# EAGLE design flatmate-long (EAGLE 5.10)
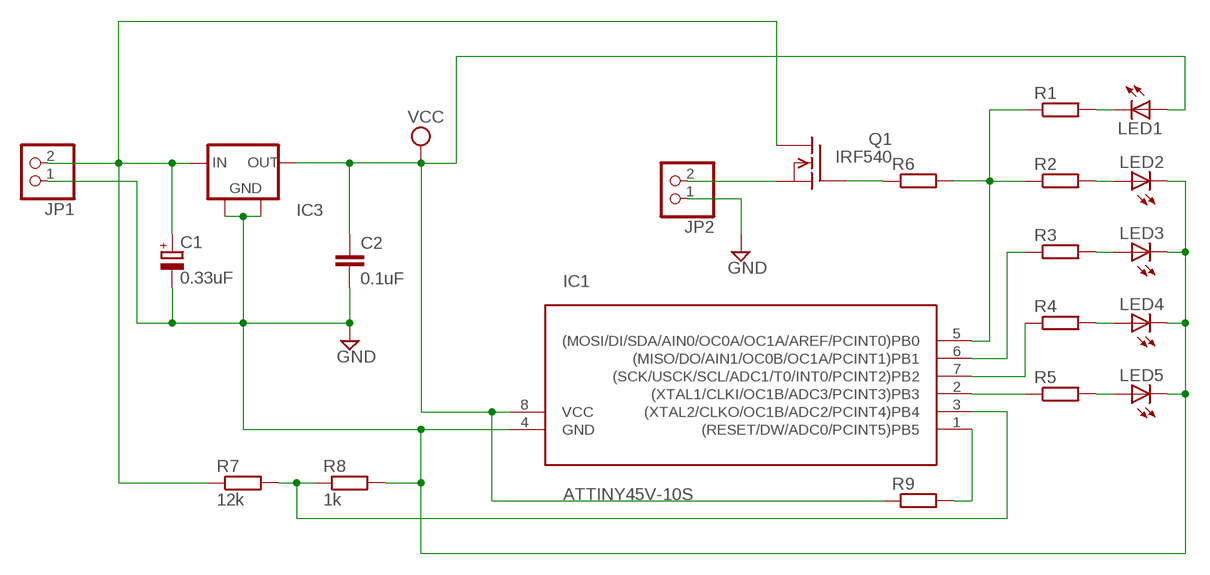
[diagram p0: schematic, sheet 1]

## Parts
C1  0.33uF  CPOL-EU153CLV-0405  [153CLV-0405]
C2  0.1uF  C-EUC0805  [C0805]
IC1  ATTINY45V-10S  [SOIC8]
IC3  78LXX-4SOT89  [SOT89R]
JP1  PINHD-1X2  [1X02]
JP2  PINHD-1X2  [1X02]
LED1  LEDCHIPLED_1206  [CHIPLED_1206]
LED2  LEDCHIPLED_1206  [CHIPLED_1206]
LED3  LEDCHIPLED_1206  [CHIPLED_1206]
LED4  LEDCHIPLED_1206  [CHIPLED_1206]
LED5  LEDCHIPLED_1206  [CHIPLED_1206]
Q1  IRF540  [TO220]
R1  R-EU_M0805  [M0805]
R2  R-EU_M0805  [M0805]
R3  R-EU_M0805  [M0805]
R4  R-EU_M0805  [M0805]
R5  R-EU_M0805  [M0805]
R6  R-EU_M0805  [M0805]
R7  12k  R-EU_M0805  [M0805]
R8  1k  R-EU_M0805  [M0805]
R9  R-EU_M0805  [M0805]

## Nets
GND: C1.- C2.2 IC1.4(GND) IC3.3(GND) IC3.4(GND) JP1.1 JP2.1 LED2.C LED3.C LED4.C LED5.C R8.2
N$1: LED1.C R1.2
N$2: Q1.1(G) R6.1
N$3: JP2.2 Q1.3(S)
N$4: IC1.1((RESET/DW/ADC0/PCINT5)PB5) R9.2
N$5: IC1.2((XTAL1/CLKI/OC1B/ADC3/PCINT3)PB3) R5.1
N$6: LED5.A R5.2
N$7: IC1.7((SCK/USCK/SCL/ADC1/T0/INT0/PCINT2)PB2) R4.1
N$8: LED4.A R4.2
N$9: IC1.6((MISO/DO/AIN1/OC0B/OC1A/PCINT1)PB1) R3.1
N$10: IC1.5((MOSI/DI/SDA/AIN0/OC0A/OC1A/AREF/PCINT0)PB0) R1.1 R2.1 R6.2
N$11: LED3.A R3.2
N$12: LED2.A R2.2
VCC: C2.1 IC1.8(VCC) IC3.2(OUT) LED1.A R9.1
VIN: C1.+ IC3.1(IN) JP1.2 Q1.2(D) R7.1
VSENSE: IC1.3((XTAL2/CLKO/OC1B/ADC2/PCINT4)PB4) R7.2 R8.1

## Library data of the parts
C1 = rcl:CPOL-EU: POLARIZED CAPACITOR, European symbol
C2 = rcl:C-EU: CAPACITOR, European symbol
IC1 = avr:ATTINY45: MICROCONTROLLER 4 Kbytes FLASH 256 bytes EEPROM 256 bytes RAM 4-channel 10 bit ADC USI
IC3 = ads4:78LXX-4: 78LXX low-power regulator -- 3-pin-plus-tab version
JP1 JP2 = pinhead:PINHD-1X2: PIN HEADER
LED1-LED5 = led:LED: LED OSRAM: - CHIPLED LG R971, LG N971, LY N971, LG Q971, LY Q971, LO R971, LY R971 LH N974, LH R974 LS Q976, LO Q976, LY Q976 LO Q996 - Hyper CHIPLED LW Q18S LB Q993, LB Q99A, LB R99A - SideLED LS A670, LO A670, LY A670, LG A670, LP A670 LB A673, LV A673, LT A673, LW A673 LH A674 LY A675 LS A676, LA A676, LO A676, LY A676, LW A676 LS A679, LY A679, LG A679 - Hyper Micro SIDELED® LS Y876, LA Y876, LO Y876, LY Y876 LT Y87S - SmartLED LW L88C, LW L88S LB L89C, LB L89S, LG L890 LS L89K, LO L89K, LY L89K LS L896, LA L896, LO L896, LY L896 - TOPLED LS T670, LO T670, LY T670, LG T670, LP T670 LSG T670, LSP T670, LSY T670, LOP T670, LYG T670 LG T671, LOG T671, LSG T671 LB T673, LV T673, LT T673, LW T673 LH T674 LS T676, LA T676, LO T676, LY T676, LB T676, LH T676, LSB T676, LW T676 LB T67C, LV T67C, LT T67C, LS T67K, LO T67K, LY T67K, LW E67C LS E67B, LA E67B, LO E67B, LY E67B, LB E67C, LV E67C, LT E67C LW T67C LS T679, LY T679, LG T679 LS T770, LO T770, LY T770, LG T770, LP T770 LB T773, LV T773, LT T773, LW T773 LH T774 LS E675, LA E675, LY E675, LS T675 LS T776, LA T776, LO T776, LY T776, LB T776 LHGB T686 LT T68C, LB T68C - Hyper Mini TOPLED® LB M676 - Mini TOPLED Santana® LG M470 LS M47K, LO M47K, LY M47K Source: http://www.osram.convergy.de LUXEON: - LUMILED® LXK2-PW12-R00, LXK2-PW12-S00, LXK2-PW14-U00, LXK2-PW14-V00 LXK2-PM12-R00, LXK2-PM12-S00, LXK2-PM14-U00 LXK2-PE12-Q00, LXK2-PE12-R00, LXK2-PE12-S00, LXK2-PE14-T00, LXK2-PE14-U00 LXK2-PB12-K00, LXK2-PB12-L00, LXK2-PB12-M00, LXK2-PB14-N00, LXK2-PB14-P00, LXK2-PB14-Q00 LXK2-PR12-L00, LXK2-PR12-M00, LXK2-PR14-Q00, LXK2-PR14-R00 LXK2-PD12-Q00, LXK2-PD12-R00, LXK2-PD12-S00 LXK2-PH12-R00, LXK2-PH12-S00 LXK2-PL12-P00, LXK2-PL12-Q00, LXK2-PL12-R00 Source: www.luxeon.com KINGBRIGHT: KA-3528ASYC Source: www.kingbright.com
Q1 = transistor-fet:IRF540: N-Channel Enhancement MOSFET (HEXFET); 100V; 28A; 0,077Ohm
R1-R9 = rcl:R-EU_: RESISTOR, European symbol

## Board
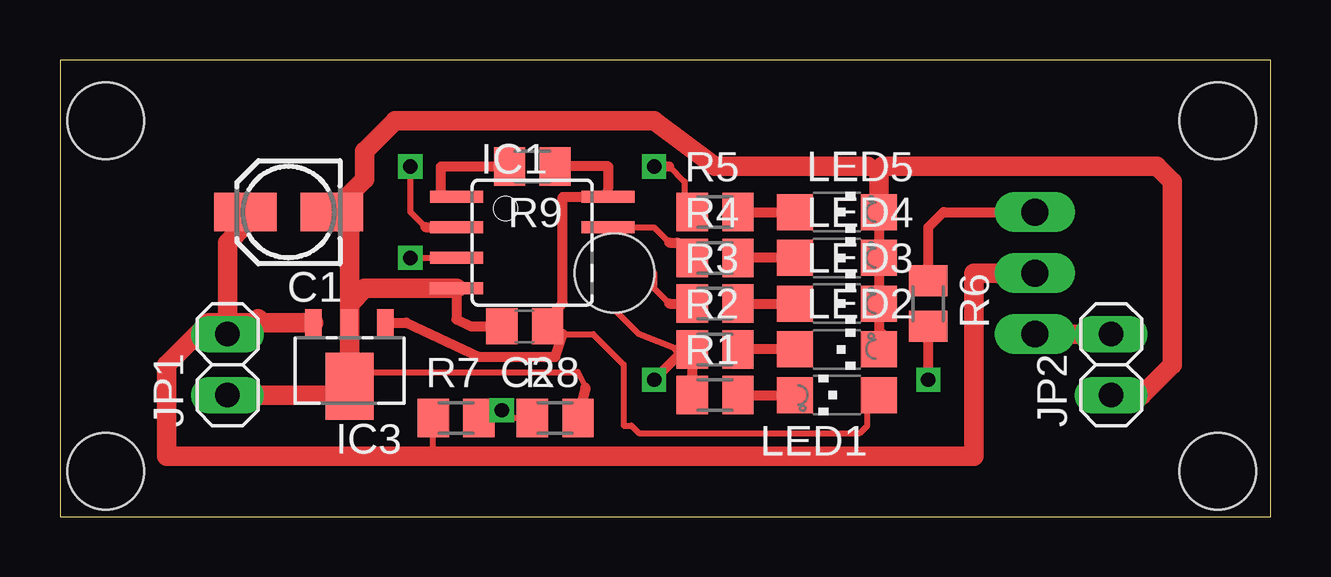
[diagram p1: board, top side]
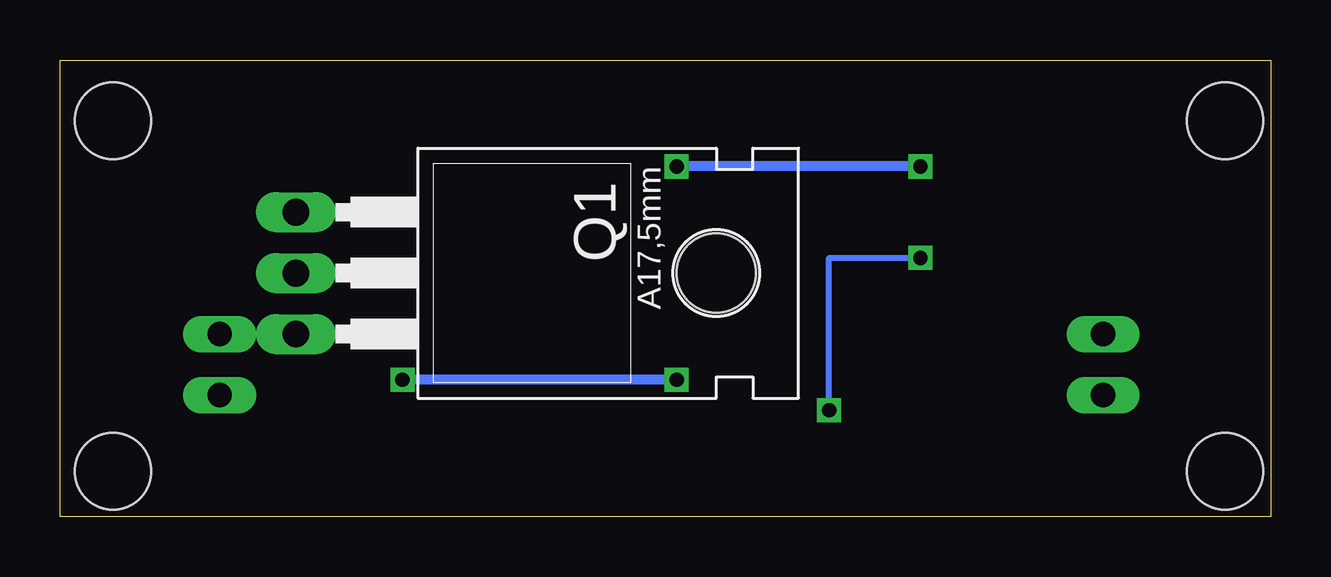
[diagram p2: board, bottom side, seen from below]

Size 50.47 x 19.04 mm. Coordinates in mm from the lower left corner, seen from the top.
Outline: 0,0 50.47,0 50.47,19.04 0,19.04 0,0
Copper layers (1*16): Top 0.035mm / dielectric 1.5mm / Bottom 0.035mm
Design rules "default": minimum track width 10mil, minimum drill 0.6mm, track to track 8mil, track to pad 8mil, pad to pad 8mil, via to via 8mil, smd to smd 8mil, copper to edge 40mil, drill to drill 8mil, minimum pad ring 10mil, minimum via ring 8mil, stop-mask expansion 4mil, vias tented up to drill 0mil, thermal gap 10mil
Holes 3.17 mm at 1.91,1.91 1.91,16.51 48.26,16.51 48.26,1.91

### Footprints (pad centres in the part's own frame; a part is rotated, then mirrored left to right if it is on the bottom)
153CLV-0405 = smd 2.6 x 1.6: + 1.8,0; - -1.8,0
C0805 = smd 1.3 x 1.5: 1 -0.95,0; 2 0.95,0
SOIC8 = smd 0.5 x 2.2: 1 -1.905,-3.154; 2 -0.645,-3.154; 3 0.625,-3.154; 4 1.895,-3.154; 5 1.905,3.154; 6 0.635,3.154; 7 -0.635,3.154; 8 -1.905,3.154
SOT89R = smd 0.7 x 1.1: 1 1.5,-1.75; 2 -1.5,-1.75; 3 0,-1.75 | smd 2 x 2.8: 4 0,0.9
1X02 = drill 1.016 long: 1 -1.27,0; 2 1.27,0
CHIPLED_1206 = smd 1.5 x 1.5: A 0,-1.75; C 0,1.75
TO220 = drill 1.118 long: 1 -2.54,-6.35; 2 0,-6.35; 3 2.54,-6.35 | hole 3.302: 0,11.176
M0805 = smd 1.3 x 1.6: 1 -0.95,0; 2 0.95,0

### Placement (x,y rotation side)
C1  9.53,12.7 180 top
C2  19.37,7.94 180 top
IC1  19.68,11.43 270 top
IC3  12.06,6.35 180 top
JP1  6.99,6.35 90 top
JP2  43.81,6.35 90 top
LED1  32.38,5.08 90 top
LED2  32.38,6.99 270 top
LED3  32.38,8.89 270 top
LED4  32.38,10.79 270 top
LED5  32.38,12.7 270 top
Q1  34.29,10.16 270 bottom
R1  27.3,5.08 0 top
R2  27.3,6.99 0 top
R3  27.3,8.89 0 top
R4  27.3,10.79 0 top
R5  27.3,12.7 0 top
R6  36.2,8.89 270 top
R7  16.51,4.13 0 top
R8  20.64,4.13 0 top
R9  19.68,14.61 180 top

### Tracks (layer width: path | path; a pad name or v marks a point on that pad's centre or on a via)
GND
  Top 0.254: 21.91,5.4 21.59,6.03 12.01,6.03
  Top 0.406: 11.7,5.08 IC3.4 12.01,6.03 | 12.06,11.96 C1.- | IC3.3 12.06,8.89 | 16.52,9.53 IC1.4 16.53,8.23 17.14,7.94 C2.2 | 21.59,4.45 R8.2 21.91,5.4 | 33.66,14.61 33.97,14.29 | 33.97,14.29 34.13,14.12 | LED5.C LED4.C LED3.C LED2.C 34.29,6.99 34.29,7.62 | 33.97,14.29 34.29,14.61
  Top 0.813: JP1.1 11.7,5.08 | 12.06,11.96 IC3.3 IC3.4 | 12.06,8.89 12.7,9.53 16.52,9.53 | 34.13,14.12 LED5.C | 33.66,14.61 27.3,14.61 24.77,16.51 13.97,16.51 12.7,15.24 12.7,14.07 C1.- | JP2.1 45.09,5.08 46.35,6.35 46.35,13.97 45.72,14.61 34.29,14.61
N$1
  Top 0.406: R1.2 LED1.C
N$2
  Top 0.406: R6.1 36.2,12.06 36.83,12.7 Q1.1
N$3
  Top 0.813: Q1.3 JP2.2
N$4
  Top 0.406: IC1.1 15.88,13.34 15.88,14.61 R9.2
N$5  (via drill 0.6)
  Top 0.254: 15.23,12.07 14.61,12.7 v14.61,14.61 | 26.04,13.02 26.04,13.97 25.4,14.61
  Top 0.406: 15.23,12.07 IC1.2 | 26.04,13.02 R5.1 | v24.77,14.61 25.4,14.61
  Bottom 0.406: v14.61,14.61 v24.77,14.61
N$6
  Top 0.406: R5.2 LED5.A
N$7
  Top 0.254: IC1.7 24.77,12.06 25.4,11.43
  Top 0.406: 25.4,11.43 25.72,11.43 R4.1
N$8
  Top 0.406: LED4.A R4.2
N$9
  Top 0.254: IC1.6 24.13,10.79 24.77,10.16 24.77,9.53 25.4,8.89
  Top 0.406: 25.4,8.89 R3.1
N$10  (via drill 0.6)
  Top 0.254: IC1.5 22.84,8.91 24.13,7.62 25.72,6.99
  Top 0.406: R2.1 25.72,6.99 | R1.1 R2.1 | R2.1 26.04,6.99 v24.77,5.71 | v36.2,5.71 R6.2
  Bottom 0.406: v24.77,5.71 v36.2,5.71
N$11
  Top 0.406: R3.2 LED3.A
N$12
  Top 0.406: LED2.A R2.2
VCC
  Top 0.254: 20.95,7.62 22.23,7.62 23.5,6.35 23.5,3.81 23.81,3.81 24.13,3.49 33.34,3.49 33.66,3.81 33.66,4.6
  Top 0.406: R9.1 22.86,14.61 22.86,13.99 IC1.8 20.95,13.34 20.95,8.89 20.64,8.57 C2.1 20.95,7.62 20.64,6.67 17.46,6.67 14.44,8.1 IC3.2 | 33.66,4.6 LED1.A
VIN
  Top 0.254: R7.1 15.56,2.85 15.88,2.54
  Top 0.406: 7.62,7.62 JP1.2 | 8.26,8.26 10.41,8.26 IC3.1 | 7.72,12.17 C1.+
  Top 0.813: 8.26,8.26 7.62,7.62 | IC3.1 6.2,8.1 4.45,6.35 4.45,2.54 15.88,2.54 38.1,2.54 38.1,10.16 Q1.2 | 7.72,12.17 6.99,11.43 JP1.2
VSENSE  (via drill 0.6)
  Top 0.254: R8.1 R7.2 18.1,4.13 v18.41,4.45 | v14.61,10.79 IC1.3
  Bottom 0.254: v18.41,4.45 18.41,10.79 v14.61,10.79